# Altium schematic sheet interface.SchDoc
size A4; Date: 2020/05/29
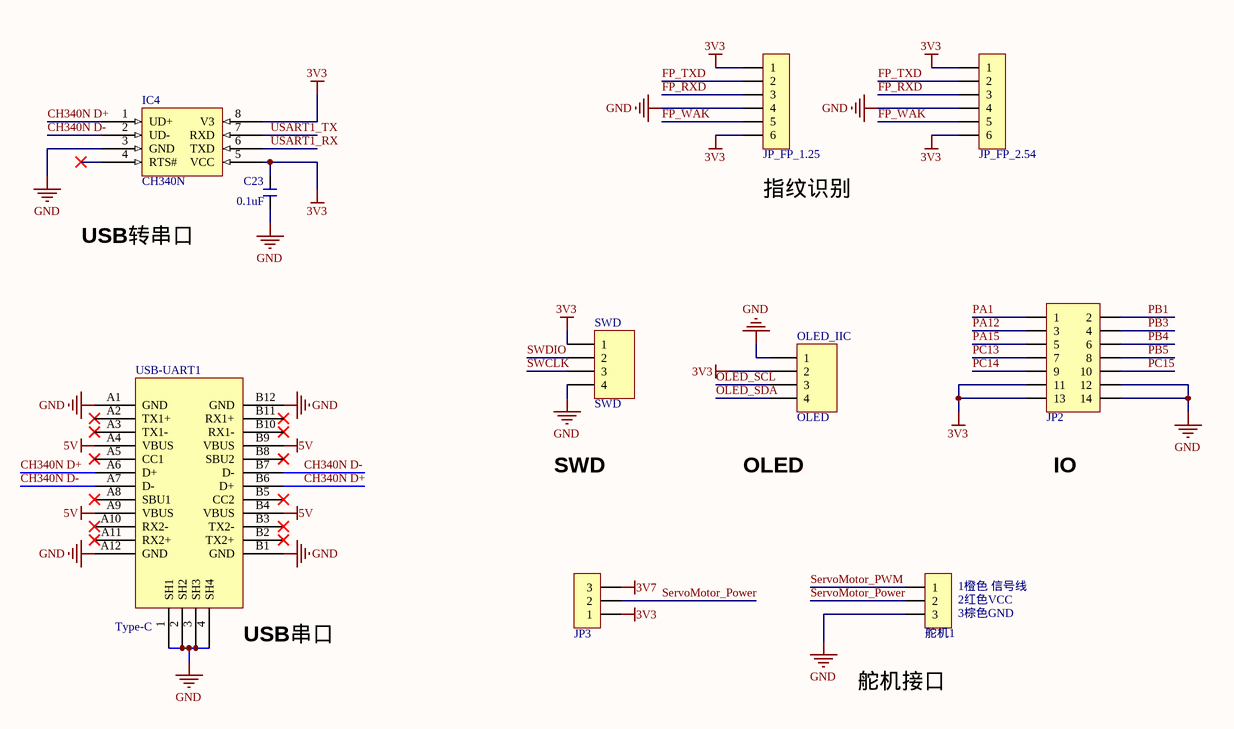
[diagram p0: interface.SchDoc]

## Parts
C23  0.1uF  [C 0603_M]
IC4  CH340N  [SOP8_N]
JP2  Header 2X7  [HDR2.54-LI-2x7P]  (value not drawn)
JP3  HDR-1X3  [HDR2.54-LI-3P]  (value not drawn)
JP_FP_1.25  HDR-1X6  [MX 1.25-WS-6P]  (value not drawn)
JP_FP_2.54  HDR-1X6  [HDR2.54-LI-2x3P]  (value not drawn)
OLED_IIC  OLED  [HDR2.54-LI-4P]
SWD  SWD  [HDR2.54-LI-4P]
USB-UART1  Type-C  [TYPE-C]
舵机1  HDR-1X3  [HDR2.54-LI-3P]  (value not drawn)

## Nets
3V3: C23.2 IC4.5(VCC) IC4.8(V3) JP2.11 JP2.13 JP3.1 JP_FP_1.25.1 JP_FP_1.25.6 JP_FP_2.54.1 JP_FP_2.54.6 OLED_IIC.2 SWD.1
3V7: JP3.3
5V: USB-UART1.A4(VBUS) USB-UART1.A9(VBUS) USB-UART1.B4(VBUS) USB-UART1.B9(VBUS)
GND: C23.1 IC4.3(GND) JP2.12 JP2.14 JP_FP_1.25.4 JP_FP_2.54.4 OLED_IIC.1 SWD.4 USB-UART1.1(SH1) USB-UART1.2(SH2) USB-UART1.3(SH3) USB-UART1.4(SH4) USB-UART1.A1(GND) USB-UART1.A12(GND) USB-UART1.B1(GND) USB-UART1.B12(GND) 舵机1.3
CH340N D+: IC4.1(UD+) USB-UART1.A6(D+) USB-UART1.B6(D+)
CH340N D-: IC4.2(UD-) USB-UART1.A7(D-) USB-UART1.B7(D-)
FP_RXD: JP_FP_1.25.3 JP_FP_2.54.3
FP_TXD: JP_FP_1.25.2 JP_FP_2.54.2
FP_WAK: JP_FP_1.25.5 JP_FP_2.54.5
OLED_SCL: OLED_IIC.3
OLED_SDA: OLED_IIC.4
PA1: JP2.1
PA12: JP2.3
PA15: JP2.5
PB1: JP2.2
PB3: JP2.4
PB4: JP2.6
PB5: JP2.8
PC13: JP2.7
PC14: JP2.9
PC15: JP2.10
ServoMotor_Power: JP3.2 舵机1.2
ServoMotor_PWM: 舵机1.1
SWCLK: SWD.3
SWDIO: SWD.2
USART1_RX: IC4.6(TXD)
USART1_TX: IC4.7(RXD)

Not connected (* = marked no-connect by the designer): IC4 4(RTS#)*; USB-UART1 A2(TX1+)* A3(TX1-)* A5(CC1)* A8(SBU1)* A10(RX2-)* A11(RX2+)* B2(TX2+)* B3(TX2-)* B5(CC2)* B8(SBU2)* B10(RX1-)* B11(RX1+)*

## Notes on the sheet
- USB转串口
- (near JP_FP_1.25) 指纹识别
- SWD
- OLED
- IO
- (near USB-UART1) USB串口
- (near 舵机1) 1橙色 信号线
- (near 舵机1) 2红色VCC
- (near 舵机1) 3棕色GND
- 舵机接口
- Title:
- A4
- Name:
- Date:
- Author@
- firestaradmin

## Library data of the parts
C23 = C: 无极性贴片电容; 版权归属: 源创客; BOM名称: 无极性贴片电容; 学习资源: www.ooocke.com
IC4 = CH340N: USB 转串口芯片 CH330/CH340N
JP2 = Header 7X2: 7*2P接插件; 版权归属: 源创客; BOM名称: 7*2P接插件; 学习资源: www.ooocke.com
JP3 舵机1 = Header 3: 3P接插件; 版权归属: 源创客; BOM名称: 3P接插件; 学习资源: www.ooocke.com
JP_FP_1.25 JP_FP_2.54 = Header 6: 6P接插件; 版权归属: 源创客; BOM名称: 6P接插件; 学习资源: www.ooocke.com
OLED_IIC SWD = Header 4: Header, 4-Pin; LatestRevisionDate: 17-Jul-2002; LatestRevisionNote: Re-released for DXP Platform.; Publisher: Altium Limited